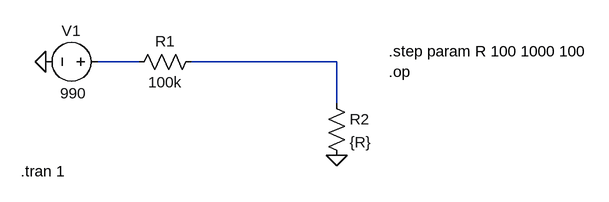
[diagram p0: schematic c02ex09s01.asc]
c02ex09s01.asc, the LTspice schematic file:
Version 4
SHEET 1 880 680
WIRE 144 128 80 128
WIRE 448 128 224 128
WIRE 448 192 448 128
FLAG 0 128 0
FLAG 448 272 0
SYMBOL res 128 144 R270
WINDOW 0 32 56 VTop 2
WINDOW 3 0 56 VBottom 2
SYMATTR InstName R1
SYMATTR Value 100k
SYMBOL res 432 176 R0
SYMATTR InstName R2
SYMATTR Value {R}
SYMBOL voltage 96 128 R90
WINDOW 0 -32 56 VBottom 2
WINDOW 3 64 53 VBottom 2
WINDOW 123 0 0 Left 0
WINDOW 39 0 0 Left 0
SYMATTR InstName V1
SYMATTR Value 990
TEXT -38 296 Left 2 !.tran 1
TEXT 528 112 Left 2 !.step param R 100 1000 100\n.op

The netlist it stands for:
* c02ex09s01.asc
R1 N001 N002 100k
R2 N002 0 {R}
V1 N001 0 990
.tran 1
.step param R 100 1000 100
.op
.backanno
.end